# Altium schematic sheet MPU.SchDoc
size A4
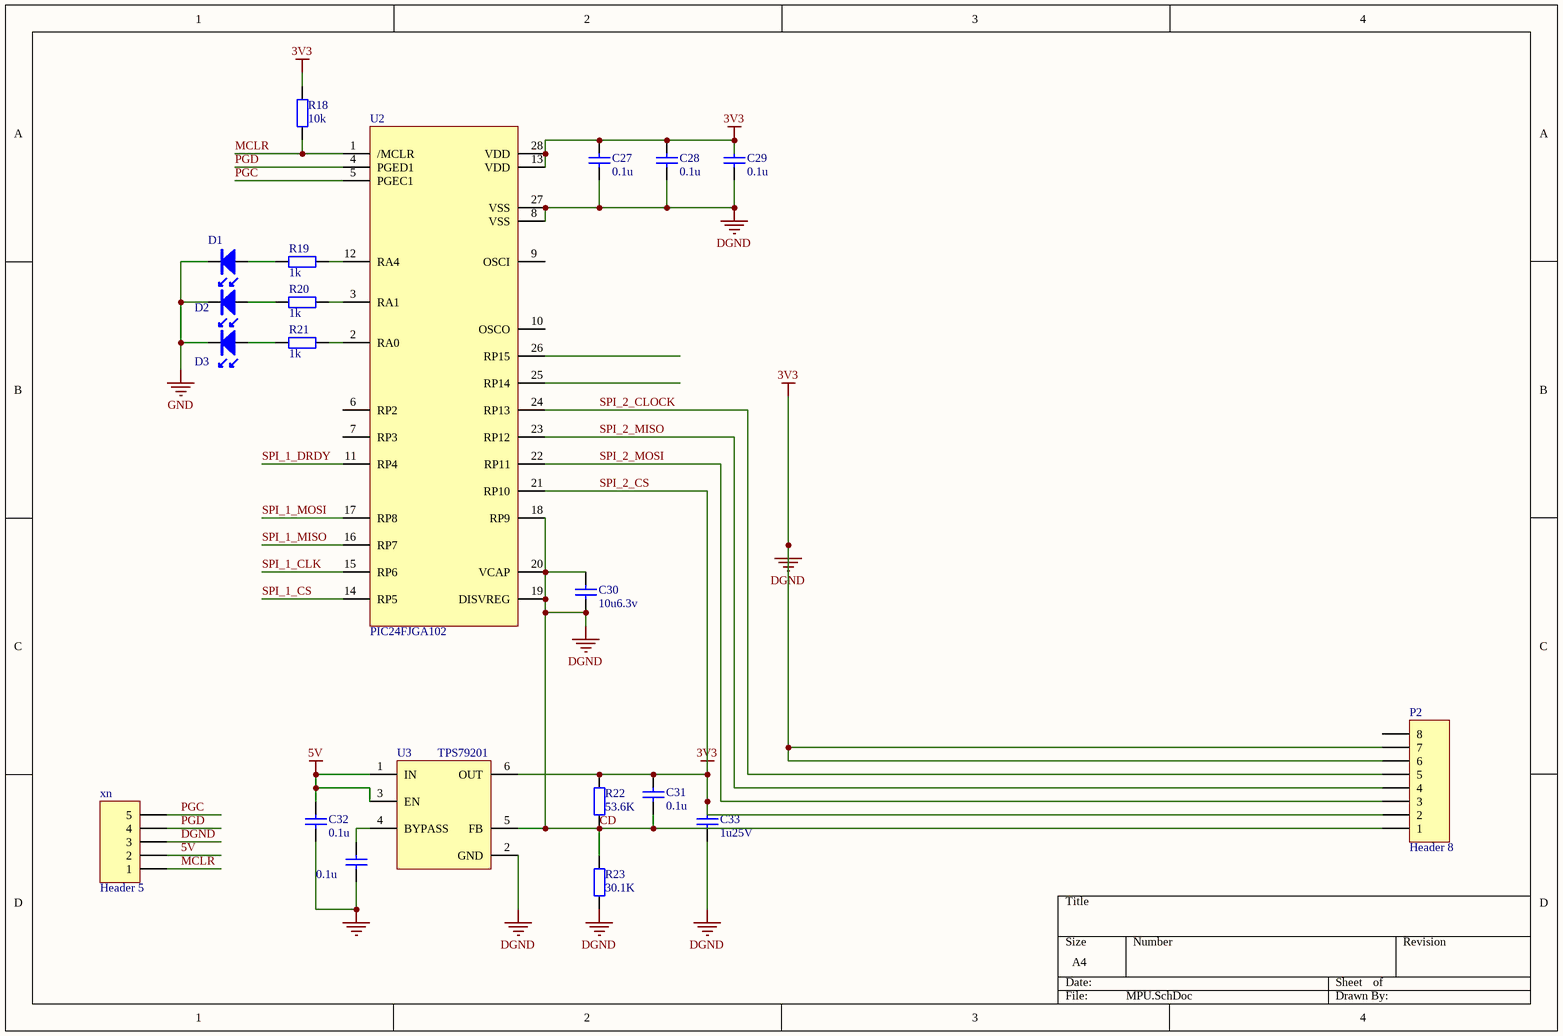
[diagram p0: MPU.SchDoc]

## Parts
?  0.1u  [CAP-C0603-H0.9mm]
C27  0.1u  [CAP-C1210-H2.2MM]
C28  0.1u  [CAP-C1210-H2.2MM]
C29  0.1u  [CAP-C1210-H2.2MM]
C30  10u6.3v  [CAP-C1210-H2.2MM]
C31  0.1u  [CAP-C0603-H0.9mm]
C32  0.1u  [CAP-C0603-H0.9mm]
C33  1u25V  [CAP-C1210-H2.2MM]
D1  LED  [LED0603]  (value not drawn)
D2  LED  [LED0603]  (value not drawn)
D3  LED  [LED0603]  (value not drawn)
P2  Header 8  [HDR1X8]
R18  10k  [RES-0805-H0.6mm]
R19  1k  [R0603]
R20  1k  [R0603]
R21  1k  [R0603]
R22  53.6K  [R0603]
R23  30.1K  [R0603]
U2  PIC24FJGA102
U3  TPS79201
xn  Header 5  [HDR1X5]

## Nets
5V: C32.2 U3.1(IN) U3.3(EN) xn.2
CD: C27.1 C27.2 C28.1 C28.2 C29.1 C29.2 C30.1 C30.2 C31.1 C31.2 C33.1 C33.2 P2.1 P2.2 P2.6 P2.7 R18.2 R22.1 R22.2 R23.1 R23.2 U2.8(VSS) U2.13(VDD) U2.18(RP9) U2.19(DISVREG) U2.20(VCAP) U2.21(RP10) U2.27(VSS) U2.28(VDD) U3.2(GND) U3.5(FB) U3.6(OUT) xn.3  [also labelled 3V3, DGND, SPI_2_CS]
GND: ?.1 C32.1 D1.K D2.K D3.K
MCLR: R18.1 U2.1(/MCLR) xn.1
PGC: U2.5(PGEC1) xn.5
PGD: U2.4(PGED1) xn.4
SPI_1_CLK: U2.15(RP6)
SPI_1_CS: U2.14(RP5)
SPI_1_DRDY: U2.11(RP4)
SPI_1_MISO: U2.16(RP7)
SPI_1_MOSI: U2.17(RP8)
SPI_2_CLOCK: P2.5 U2.24(RP13)
SPI_2_MISO: P2.4 U2.23(RP12)
SPI_2_MOSI: P2.3 U2.22(RP11)
Net?_2: ?.2 U3.4(BYPASS)
NetD1_A: D1.A R19.1
NetD2_A: D2.A R20.1
NetD3_A: D3.A R21.1
NetR19_2: R19.2 U2.12(RA4)
NetR20_2: R20.2 U2.3(RA1)
NetR21_2: R21.2 U2.2(RA0)

Not connected (* = marked no-connect by the designer): P2 8; U2 6(RP2) 7(RP3) 9(OSCI) 10(OSCO) 25(RP14) 26(RP15)

## Library data of the parts
? C31 C32 = C0603: CAP CER 0.1UF 50V 10% X8R 0603; Supplier Part Number 1: 445-8818-1-ND
  ?: Supplier 1: Digi-Key
  C31: Supplier 1: Digi-Key; digikey part number: 478-1244-1-ND
  C32: digikey part number: 478-1244-1-ND
C27-C30 C33 = C0603: CER 10UF 25V X8R 1210
  C27-C29 C33: Supplier 1: Digi-Key; Supplier Part Number 1: 445-174833-1-ND
  C30: digikey part number: 445-11185-1-ND; ComponentLink1Description: digikey link; ComponentLink1URL: https://www.digikey.ca/product-detail/en/tdk-corporation/C1608JB0J106K080AB/445-11185-1-ND/3952851
D1-D3 = LED_RED_CLEAR_0603: LED GREEN CLEAR 0603 SMD; CMT: APT2012LVBC/D; Supplier 1: Digi-Key; Supplier Part Number 1: 732-4971-1-ND
P2 = Header 8: Header, 8-Pin; ComponentLink1Description: digikey link; ComponentLink1URL: https://www.digikey.ca/product-detail/en/adafruit-industries-llc/254/1528-1462-ND/5761230; digikey  part number: 1528-1462-ND
R18 = R: RES SMD 33 OHM 1% 1/10W 0603; CMT: 1k; Supplier 1: Digi-Key; Supplier Part Number 1: 311-33.0HRCT-ND
R19-R21 = R0603M: 1K OHM 1% 1/10W 0603; Supplier 1: Digi-Key; Supplier Part Number 1: 311-1.00KHRCT-ND; CMT: 1k
R22 = R0603M: 169k OHM 1% 1/10W 0603; CMT: 100k; Supplier 1: Digi-Key; Supplier Part Number 1: 311-174KHRCT-ND
R23 = R0603M: SMD 39K OHM 1% 1/10W 0603; CMT: 31.6k; Supplier 1: Digi-Key; Supplier Part Number 1: P39.0KHCT-ND
xn = Header 5: Header, 5-Pin; digkey part number: AE10383-ND; ComponentLink2Description: digigkey link; ComponentLink2URL: https://www.digikey.ca/product-detail/en/assmann-wsw-components/A-2004-1-4-LP-N-R/AE10383-ND/2183634
U2 = PIC24FJGA102: ComponentLink1Description: digikey link; ComponentLink1URL: https://www.digikey.ca/product-detail/en/microchip-technology/PIC24FJ64GA102-I-SS/PIC24FJ64GA102-I-SS-ND/2651318; digikey part number: PIC24FJ64GA102-I/SS-ND
U3 = TPS79201: digikey part number: 296-11868-1-ND